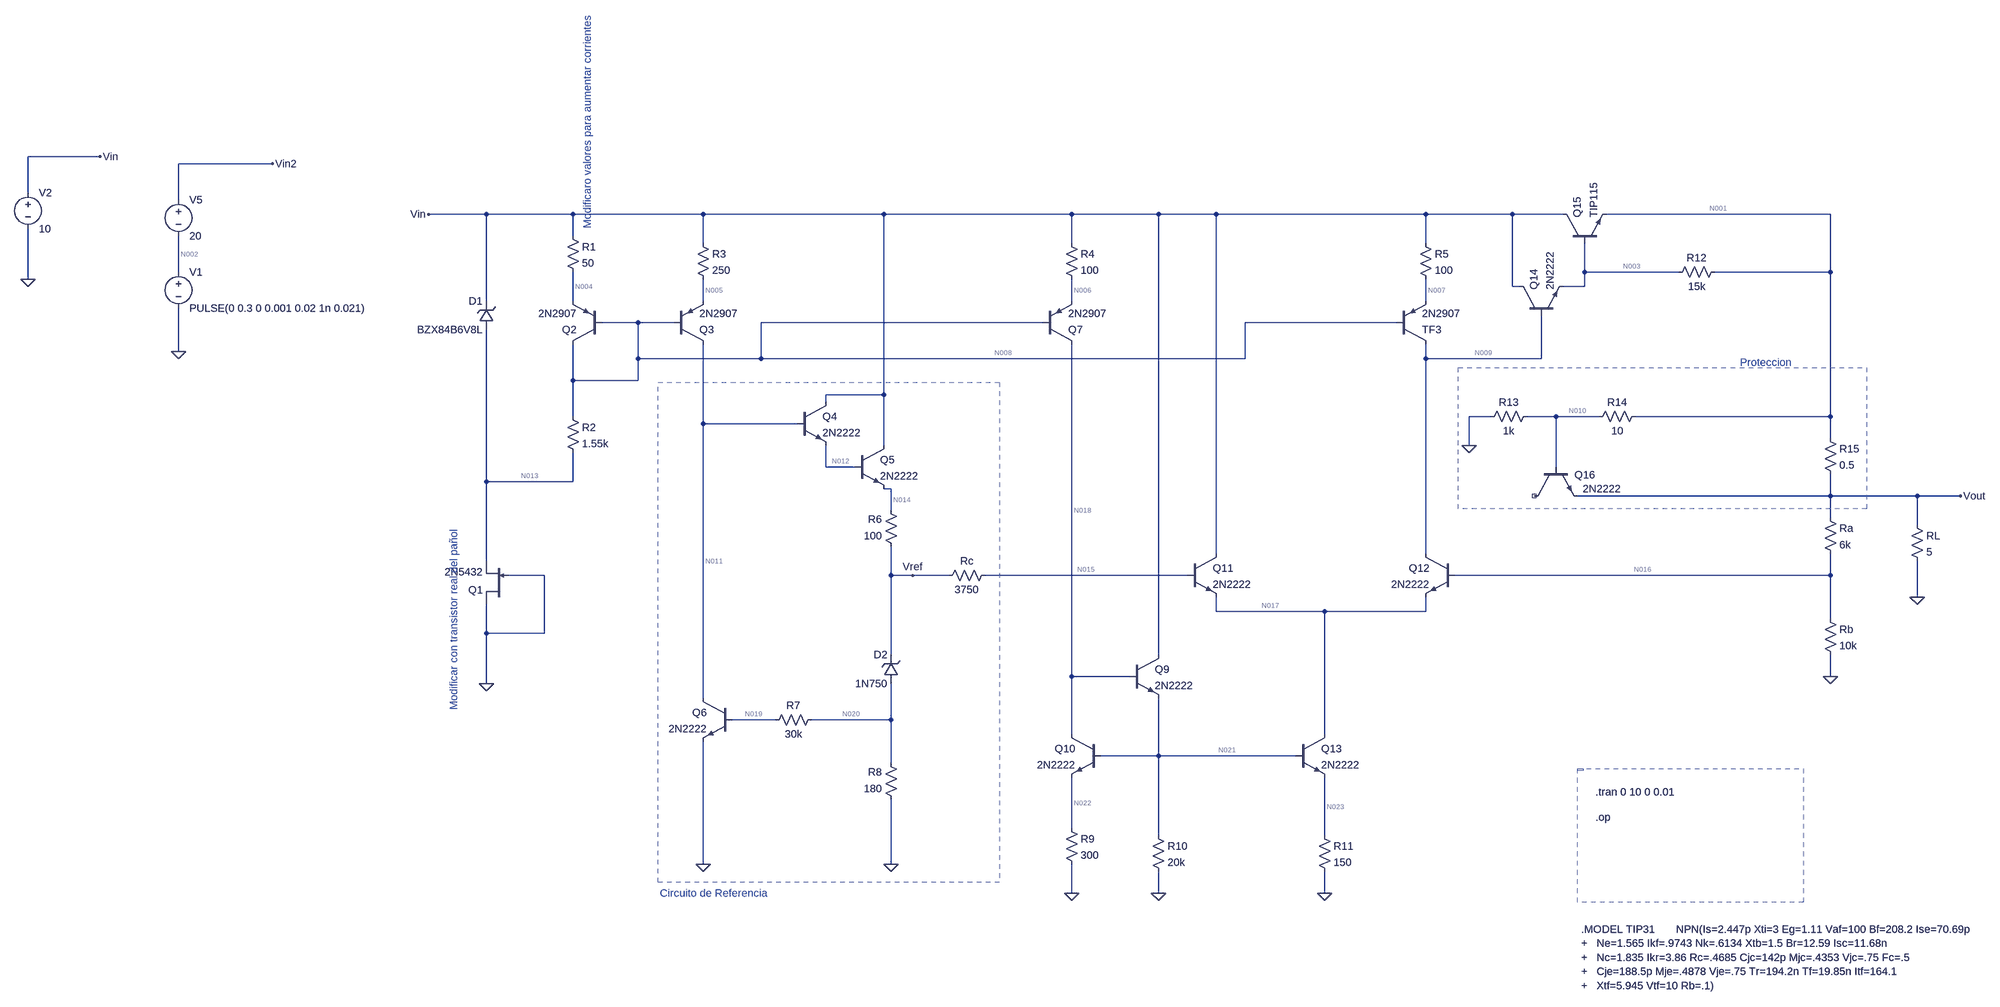
[diagram p0: schematic Test.asc]
Test.asc, the LTspice schematic file:
Version 4
SHEET 1 2264 1576
WIRE -3184 -240 -3392 -240
WIRE -2704 -224 -2912 -224
WIRE -3392 -160 -3392 -240
WIRE -2912 -144 -2912 -224
WIRE -2112 -112 -2240 -112
WIRE -1920 -112 -2112 -112
WIRE -1632 -112 -1920 -112
WIRE -1232 -112 -1632 -112
WIRE -816 -112 -1232 -112
WIRE -624 -112 -816 -112
WIRE -496 -112 -624 -112
WIRE -32 -112 -496 -112
WIRE 160 -112 -32 -112
WIRE 272 -112 160 -112
WIRE 864 -112 368 -112
WIRE -1920 -64 -1920 -112
WIRE -1632 -48 -1632 -112
WIRE -816 -48 -816 -112
WIRE -32 -48 -32 -112
WIRE -2912 16 -2912 -64
WIRE 320 16 320 -48
WIRE 528 16 320 16
WIRE 864 16 864 -112
WIRE 864 16 608 16
WIRE -3392 32 -3392 -80
WIRE 160 48 160 -112
WIRE 176 48 160 48
WIRE 320 48 320 16
WIRE 320 48 272 48
WIRE -2112 80 -2112 -112
WIRE -1920 80 -1920 16
WIRE -1632 80 -1632 32
WIRE -816 80 -816 32
WIRE -32 80 -32 32
WIRE -1776 128 -1856 128
WIRE -1696 128 -1776 128
WIRE -880 128 -1504 128
WIRE -96 128 -432 128
WIRE -2912 192 -2912 96
WIRE -1776 208 -1776 128
WIRE -1504 208 -1504 128
WIRE -1504 208 -1776 208
WIRE -432 208 -432 128
WIRE -432 208 -1504 208
WIRE -32 208 -32 176
WIRE 224 208 224 112
WIRE 224 208 -32 208
WIRE -1920 256 -1920 176
WIRE -1776 256 -1776 208
WIRE -1776 256 -1920 256
WIRE -1232 288 -1232 -112
WIRE -1232 288 -1360 288
WIRE -1360 304 -1360 288
WIRE -1920 336 -1920 256
WIRE 112 336 64 336
WIRE 256 336 192 336
WIRE 352 336 256 336
WIRE 864 336 864 16
WIRE 864 336 432 336
WIRE -1632 352 -1632 176
WIRE -1424 352 -1632 352
WIRE 864 384 864 336
WIRE -1232 400 -1232 288
WIRE 64 400 64 336
WIRE -1360 448 -1360 400
WIRE -1296 448 -1360 448
WIRE 256 448 256 336
WIRE -2112 480 -2112 144
WIRE -1920 480 -1920 416
WIRE -1920 480 -2112 480
WIRE -1216 496 -1232 496
WIRE 864 512 864 464
WIRE 864 512 304 512
WIRE 1056 512 864 512
WIRE 1152 512 1056 512
WIRE -1216 544 -1216 496
WIRE 864 560 864 512
WIRE 1056 576 1056 512
WIRE -496 640 -496 -112
WIRE -32 640 -32 208
WIRE -2112 656 -2112 480
WIRE -1984 688 -2064 688
WIRE -1216 688 -1216 624
WIRE -1168 688 -1216 688
WIRE -1088 688 -1168 688
WIRE -560 688 -1008 688
WIRE 864 688 864 640
WIRE 864 688 32 688
WIRE 1056 736 1056 656
WIRE -496 768 -496 736
WIRE -256 768 -496 768
WIRE -32 768 -32 736
WIRE -32 768 -256 768
WIRE 864 784 864 688
WIRE -2112 816 -2112 752
WIRE -1984 816 -1984 688
WIRE -1984 816 -2112 816
WIRE -1216 864 -1216 688
WIRE -624 864 -624 -112
WIRE -816 912 -816 176
WIRE -688 912 -816 912
WIRE 864 912 864 864
WIRE -2112 928 -2112 816
WIRE -1632 960 -1632 352
WIRE -1472 1008 -1568 1008
WIRE -1216 1008 -1216 928
WIRE -1216 1008 -1392 1008
WIRE -816 1040 -816 912
WIRE -256 1040 -256 768
WIRE -624 1088 -624 960
WIRE -624 1088 -752 1088
WIRE -320 1088 -624 1088
WIRE -1216 1104 -1216 1008
WIRE -816 1248 -816 1136
WIRE -624 1264 -624 1088
WIRE -256 1264 -256 1136
WIRE -1632 1328 -1632 1056
WIRE -1216 1328 -1216 1184
WIRE -816 1392 -816 1328
WIRE -624 1392 -624 1344
WIRE -256 1392 -256 1344
FLAG 1056 736 0
FLAG 864 912 0
FLAG 64 400 0
FLAG -2912 192 0
FLAG 1152 512 Vout
FLAG -1216 1328 0
FLAG -1632 1328 0
FLAG -2112 928 0
FLAG -816 1392 0
FLAG -256 1392 0
FLAG -624 1392 0
FLAG -2704 -224 Vin2
FLAG -2240 -112 Vin
FLAG -1168 688 Vref
FLAG -3184 -240 Vin
FLAG -3392 32 0
DATAFLAG 1056 512 "$"
DATAFLAG -1216 688 "$"
DATAFLAG -736 688 "$"
DATAFLAG -256 768 "$"
DATAFLAG 256 336 "$"
DATAFLAG 560 688 "$"
DATAFLAG 864 336 "$"
DATAFLAG -1776 128 "$"
DATAFLAG -2112 480 "$"
DATAFLAG -2112 -112 "$"
SYMBOL npn 176 112 R270
SYMATTR InstName Q14
SYMATTR Value 2N2222
SYMBOL npn 272 -48 R270
SYMATTR InstName Q15
SYMATTR Value TIP115
SYMBOL npn 208 448 M90
WINDOW 0 17 135 VLeft 2
WINDOW 3 48 192 VLeft 2
SYMATTR InstName Q16
SYMATTR Value 2N2222
SYMBOL npn 32 640 M0
SYMATTR InstName Q12
SYMATTR Value 2N2222
SYMBOL res 624 0 R90
WINDOW 0 0 56 VBottom 2
WINDOW 3 32 56 VTop 2
SYMATTR InstName R12
SYMATTR Value 15k
SYMBOL res 448 320 R90
WINDOW 0 0 56 VBottom 2
WINDOW 3 32 56 VTop 2
SYMATTR InstName R14
SYMATTR Value 10
SYMBOL res 208 320 R90
WINDOW 0 0 56 VBottom 2
WINDOW 3 32 56 VTop 2
SYMATTR InstName R13
SYMATTR Value 1k
SYMBOL res 848 368 R0
SYMATTR InstName R15
SYMATTR Value 0.5
SYMBOL res 848 544 R0
SYMATTR InstName Ra
SYMATTR Value 6k
SYMBOL res 1040 560 R0
SYMATTR InstName RL
SYMATTR Value 5
SYMBOL res 848 768 R0
SYMATTR InstName Rb
SYMATTR Value 10k
SYMBOL npn -560 640 R0
SYMATTR InstName Q11
SYMATTR Value 2N2222
SYMBOL zener -1200 928 R180
WINDOW 0 24 64 Left 2
WINDOW 3 24 0 Left 2
SYMATTR InstName D2
SYMATTR Value 1N750
SYMBOL res -1200 1200 R180
WINDOW 0 36 76 Left 2
WINDOW 3 36 40 Left 2
SYMATTR InstName R8
SYMATTR Value 180
SYMBOL res -1488 1024 R270
WINDOW 0 32 56 VTop 2
WINDOW 3 0 56 VBottom 2
SYMATTR InstName R7
SYMATTR Value 30k
SYMBOL npn -1568 960 M0
SYMATTR InstName Q6
SYMATTR Value 2N2222
SYMBOL npn -1424 304 R0
SYMATTR InstName Q4
SYMATTR Value 2N2222
SYMBOL npn -1296 400 R0
SYMATTR InstName Q5
SYMATTR Value 2N2222
SYMBOL res -1200 640 R180
WINDOW 0 36 76 Left 2
WINDOW 3 36 40 Left 2
SYMATTR InstName R6
SYMATTR Value 100
SYMBOL res -1104 704 R270
WINDOW 0 32 56 VTop 2
WINDOW 3 0 56 VBottom 2
SYMATTR InstName Rc
SYMATTR Value 3750
SYMBOL zener -2096 144 R180
WINDOW 0 24 64 Left 2
WINDOW 3 24 0 Left 2
SYMATTR InstName D1
SYMATTR Value BZX84B6V8L
SYMBOL pnp -1856 176 R180
SYMATTR InstName Q2
SYMATTR Value 2N2907
SYMBOL pnp -1696 176 M180
SYMATTR InstName Q3
SYMATTR Value 2N2907
SYMBOL res -1936 -80 R0
SYMATTR InstName R1
SYMATTR Value 50
SYMBOL res -1648 -64 R0
SYMATTR InstName R3
SYMATTR Value 250
SYMBOL res -1936 320 R0
SYMATTR InstName R2
SYMATTR Value 1.55k
SYMBOL njf -2064 752 R180
SYMATTR InstName Q1
SYMATTR Value 2N5432
SYMBOL pnp -96 176 M180
SYMATTR InstName TF3
SYMATTR Value 2N2907
SYMBOL res -48 -64 R0
SYMATTR InstName R5
SYMATTR Value 100
SYMBOL pnp -880 176 M180
SYMATTR InstName Q7
SYMATTR Value 2N2907
SYMBOL res -832 -64 R0
SYMATTR InstName R4
SYMATTR Value 100
SYMBOL npn -752 1040 M0
SYMATTR InstName Q10
SYMATTR Value 2N2222
SYMBOL npn -320 1040 R0
SYMATTR InstName Q13
SYMATTR Value 2N2222
SYMBOL res -832 1232 R0
SYMATTR InstName R9
SYMATTR Value 300
SYMBOL res -272 1248 R0
SYMATTR InstName R11
SYMATTR Value 150
SYMBOL npn -688 864 R0
SYMATTR InstName Q9
SYMATTR Value 2N2222
SYMBOL res -640 1248 R0
SYMATTR InstName R10
SYMATTR Value 20k
SYMBOL voltage -2912 -160 R0
SYMATTR InstName V5
SYMATTR Value 20
SYMBOL voltage -2912 0 R0
SYMATTR InstName V1
SYMATTR Value PULSE(0 0.3 0 0.001 0.02 1n 0.021)
SYMBOL voltage -3392 -176 R0
SYMATTR InstName V2
SYMATTR Value 10
TEXT 344 1168 Left 2 !.tran 0 10 0 0.01
TEXT -1888 -80 VLeft 2 ;Modificaro valores para aumentar corrientes
TEXT -2184 584 VRight 2 ;Modificar con transistor real del pañol
TEXT 312 1472 Left 2 !.MODEL TIP31	   NPN(Is=2.447p Xti=3 Eg=1.11 Vaf=100 Bf=208.2 Ise=70.69p\n+   Ne=1.565 Ikf=.9743 Nk=.6134 Xtb=1.5 Br=12.59 Isc=11.68n\n+   Nc=1.835 Ikr=3.86 Rc=.4685 Cjc=142p Mjc=.4353 Vjc=.75 Fc=.5\n+   Cje=188.5p Mje=.4878 Vje=.75 Tr=194.2n Tf=19.85n Itf=164.1\n+   Xtf=5.945 Vtf=10 Rb=.1)
TEXT 344 1224 Left 2 !.op
TEXT -1728 1392 Left 2 ;Circuito de Referencia
TEXT 664 216 Left 2 ;Proteccion
RECTANGLE Normal 316 1120 304 1116 2
RECTANGLE Normal 804 1412 304 1116 1
RECTANGLE Normal -1732 260 -976 1368 2
RECTANGLE Normal 40 228 944 540 2

The netlist it stands for:
* Test.asc
Q14 Vin N009 N003 0 2N2222
Q15 Vin N003 N001 0 TIP115
Q16 NC_01 N010 Vout 0 2N2222
Q12 N009 N016 N017 0 2N2222
R12 N001 N003 15k
R14 N001 N010 10
R13 N010 0 1k
R15 N001 Vout 0.5
Ra Vout N016 6k
RL Vout 0 5
Rb N016 0 10k
Q11 Vin N015 N017 0 2N2222
D2 N020 Vref 1N750
R8 0 N020 180
R7 N019 N020 30k
Q6 N011 N019 0 0 2N2222
Q4 Vin N011 N012 0 2N2222
Q5 Vin N012 N014 0 2N2222
R6 Vref N014 100
Rc Vref N015 3750
D1 N013 Vin BZX84B6V8L
Q2 N008 N008 N004 0 2N2907
Q3 N011 N008 N005 0 2N2907
R1 Vin N004 50
R3 Vin N005 250
R2 N008 N013 1.55k
J§Q1 0 0 N013 2N5432
Q§TF3 N009 N008 N007 0 2N2907
R5 Vin N007 100
Q7 N018 N008 N006 0 2N2907
R4 Vin N006 100
Q10 N018 N021 N022 0 2N2222
Q13 N017 N021 N023 0 2N2222
R9 N022 0 300
R11 N023 0 150
Q9 Vin N018 N021 0 2N2222
R10 N021 0 20k
V5 Vin2 N002 20
V1 N002 0 PULSE(0 0.3 0 0.001 0.02 1n 0.021)
V2 Vin 0 10
.model D D
.lib standard.dio
.model NPN NPN
.model PNP PNP
.lib standard.bjt
.model NJF NJF
.model PJF PJF
.lib standard.jft
.tran 0 10 0 0.01
* Modificaro valores para aumentar corrientes
* Modificar con transistor real del pañol
.MODEL TIP31	   NPN(Is=2.447p Xti=3 Eg=1.11 Vaf=100 Bf=208.2 Ise=70.69p
+   Ne=1.565 Ikf=.9743 Nk=.6134 Xtb=1.5 Br=12.59 Isc=11.68n
+   Nc=1.835 Ikr=3.86 Rc=.4685 Cjc=142p Mjc=.4353 Vjc=.75 Fc=.5
+   Cje=188.5p Mje=.4878 Vje=.75 Tr=194.2n Tf=19.85n Itf=164.1
+   Xtf=5.945 Vtf=10 Rb=.1)
.op
* Circuito de Referencia
* Proteccion
.backanno
.end

* Results of the author's LTspice run, read from the files saved beside the schematic
* Operating Point, zero values left out:
*   V(vin) = 10 V
*   V(n009) = 9.874 V
*   V(n003) = 9.145 V
*   V(n001) = 8.182 V
*   V(n010) = 8.098 V
*   V(vout) = 7.438 V
*   V(n016) = 4.649 V
*   V(n017) = 4.617 V
*   V(n015) = 5.3 V
*   V(n020) = 743.8 mV
*   V(vref) = 5.354 V
*   V(n019) = 644.6 mV
*   V(n011) = 7.015 V
*   V(n012) = 6.462 V
*   V(n014) = 5.769 V
*   V(n013) = 3.143 V
*   V(n008) = 9.178 V
*   V(n004) = 9.861 V
*   V(n005) = 9.824 V
*   V(n007) = 9.883 V
*   V(n018) = 1.724 V
*   V(n006) = 9.844 V
*   V(n021) = 1.137 V
*   V(n022) = 469.7 mV
*   V(n023) = 453 mV
*   V(vin2) = 20 V
*   Ic(Q7) = -1.558 mA
*   Ib(Q7) = -5.897 µA
*   Ie(Q7) = 1.564 mA
*   Ic(Tf3) = -77.55 µA
*   Ib(Tf3) = -1.095 mA
*   Ie(Tf3) = 1.173 mA
*   Ic(Q3) = -702.1 µA
*   Ib(Q3) = -2.765 µA
*   Ie(Q3) = 704.8 µA
*   Ic(Q2) = -2.779 mA
*   Ib(Q2) = -11.22 µA
*   Ie(Q2) = 2.79 mA
*   Ic(Q15) = 1.481 A
*   Ib(Q15) = 14.81 mA
*   Ie(Q15) = -1.496 A
*   Ic(Q9) = 78.91 µA
*   Ib(Q9) = 364.5 nA
*   Ie(Q9) = -79.28 µA
*   Ic(Q13) = 3.005 mA
*   Ib(Q13) = 14.66 µA
*   Ie(Q13) = -3.02 mA
*   Ic(Q10) = 1.558 mA
*   Ib(Q10) = 7.784 µA
*   Ie(Q10) = -1.566 mA
*   Ic(Q5) = 4.13 mA
*   Ib(Q5) = 20.21 µA
*   Ie(Q5) = -4.15 mA
*   Ic(Q4) = 20.11 µA
*   Ib(Q4) = 97.64 nA
*   Ie(Q4) = -20.21 µA
*   Ic(Q6) = 702 µA
*   Ib(Q6) = 3.307 µA
*   Ie(Q6) = -705.3 µA
*   Ic(Q11) = 2.991 mA
*   Ib(Q11) = 14.42 µA
*   Ie(Q11) = -3.005 mA
*   Ic(Q12) = 5.27 pA
*   Ib(Q12) = -5.197 pA
*   Ib(Q16) = 276.7 µA
*   Ie(Q16) = -276.7 µA
*   Ic(Q14) = 14.8 mA
*   Ib(Q14) = 77.55 µA
*   Ie(Q14) = -14.88 mA
*   I(D1) = -210.9 mA
*   I(D2) = -4.136 mA
*   Id(Q1) = -214.8 mA
*   Ig(Q1) = -19.05 pA
*   Is(Q1) = 214.8 mA
*   I(R10) = 56.83 µA
*   I(R11) = 3.02 mA
*   I(R9) = 1.566 mA
*   I(R4) = 1.564 mA
*   I(R5) = 1.173 mA
*   I(R2) = 3.893 mA
*   I(R3) = 704.8 µA
*   I(R1) = 2.79 mA
*   I(Rc) = 14.42 µA
*   I(R6) = -4.15 mA
*   I(R7) = -3.307 µA
*   I(R8) = -4.132 mA
*   I(Rb) = 464.9 µA
*   I(Rl) = 1.488 A
*   I(Ra) = 464.9 µA
*   I(R15) = 1.488 A
*   I(R13) = 8.098 mA
*   I(R14) = 8.375 mA
*   I(R12) = -64.2 µA
*   I(V2) = -1.72 A
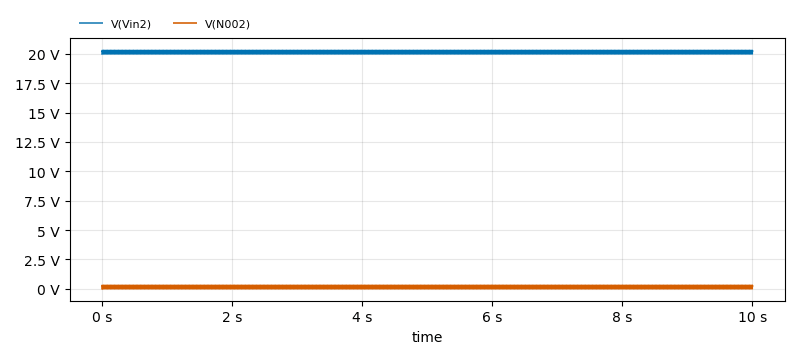
[diagram p1: Transient Analysis of Test.asc, plotted from the saved traces]
* Transient Analysis, 1 run:
*   V(Vin2): min 20 V, max 20.3 V, average 20.15 V, rms 20.15 V, last 20.26 V
*   V(N002): min 0 V, max 300 mV, average 150 mV, rms 212 mV, last 255 mV